# EAGLE board nano-esp-stm-breakout (EAGLE 9.6.2)
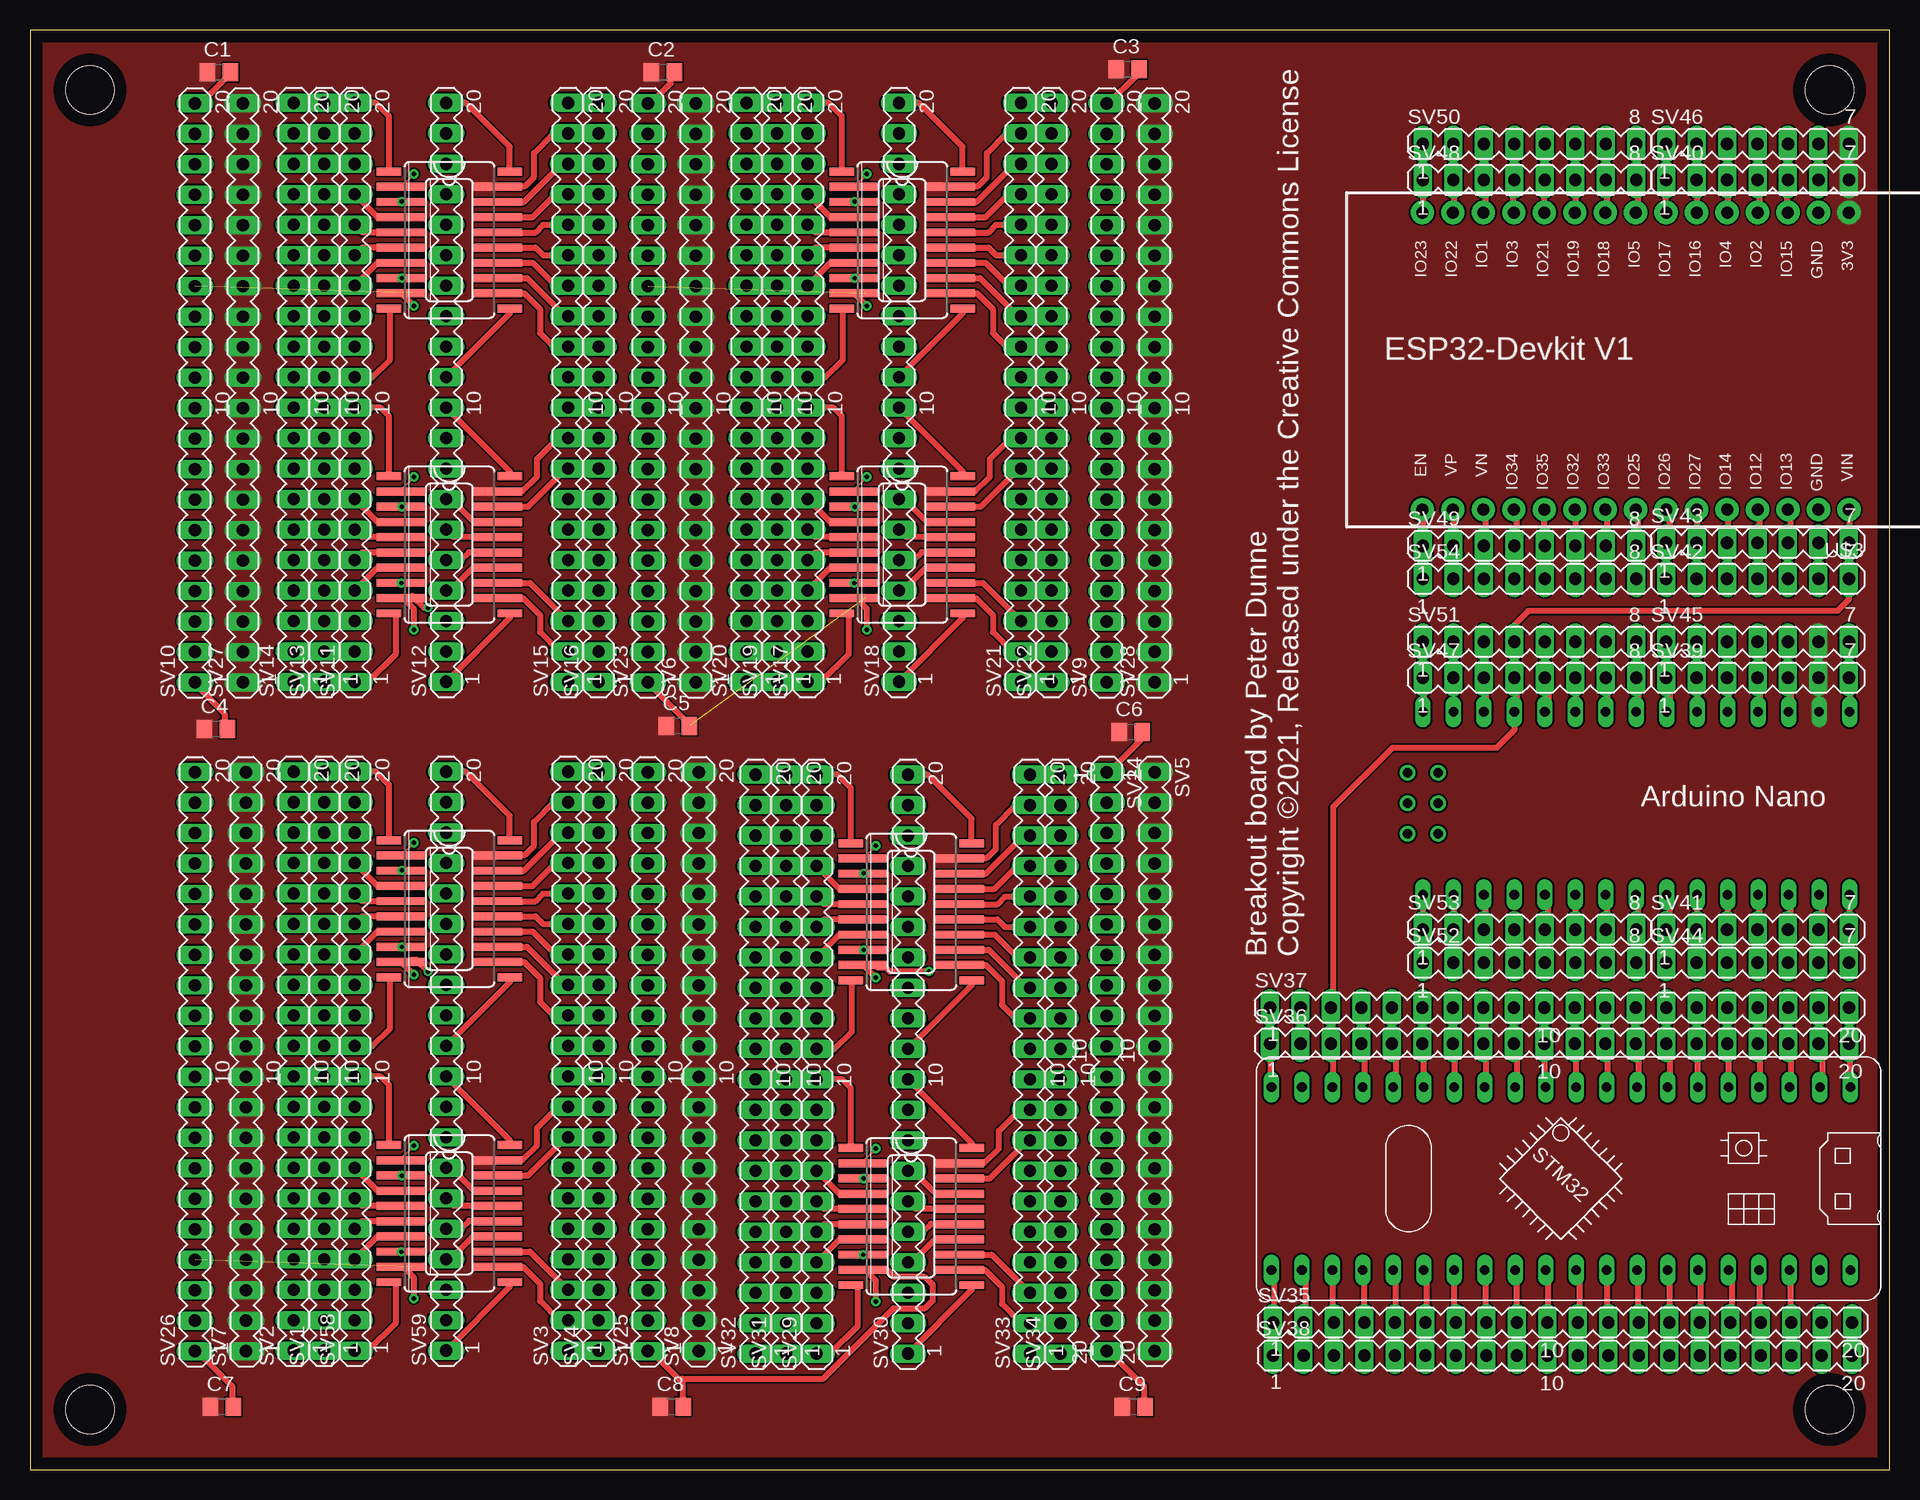
[diagram p2: board, top side]
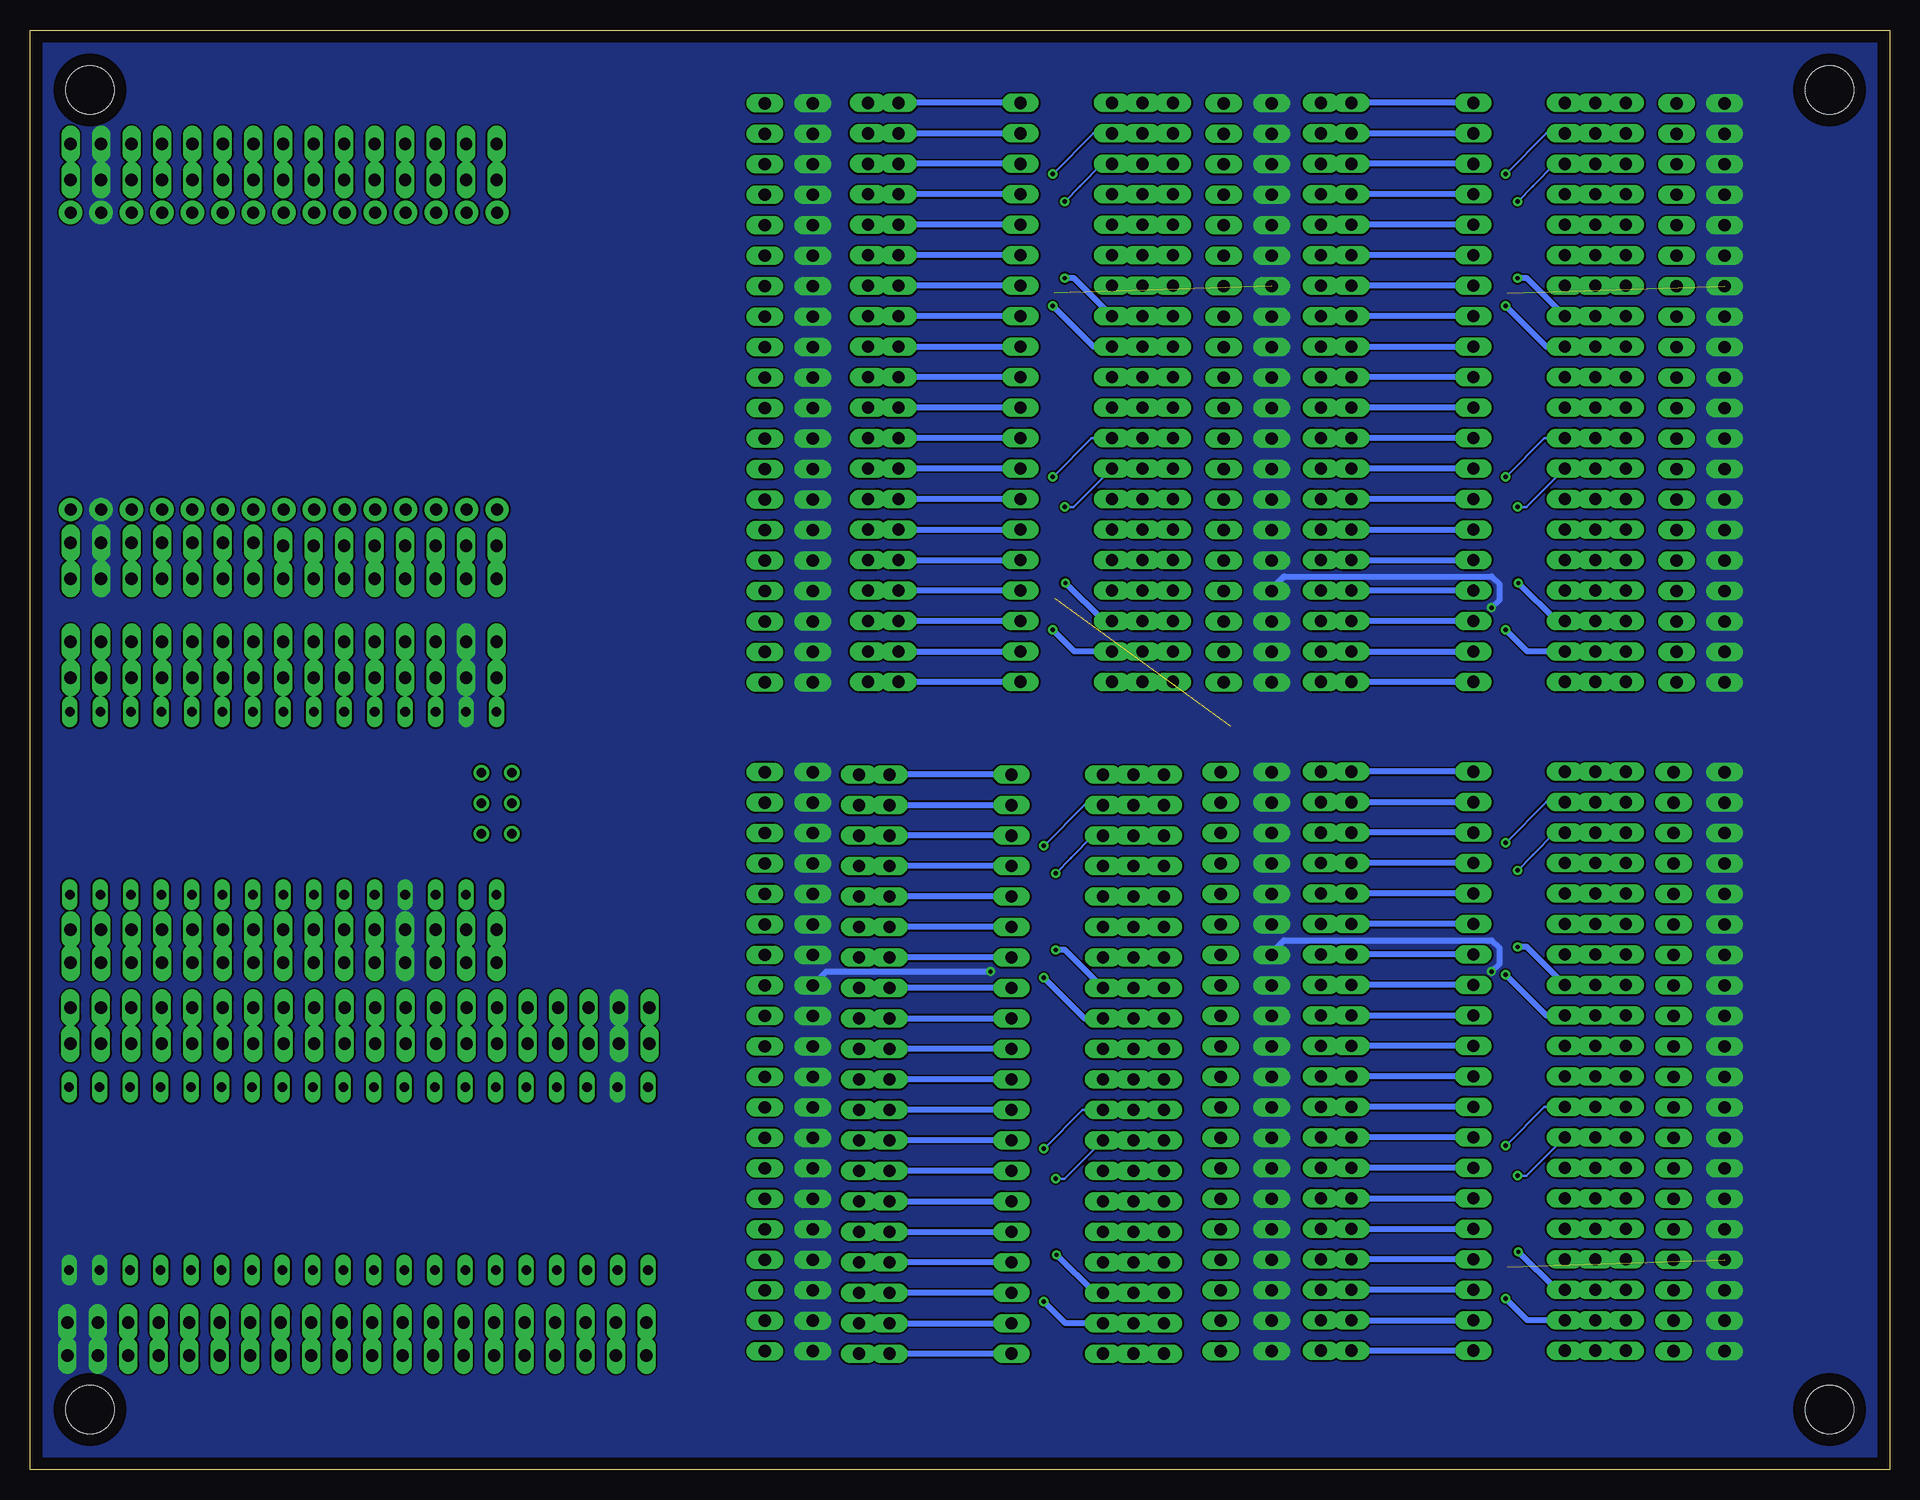
[diagram p3: board, bottom side, seen from below]

Size 155 x 120 mm. Coordinates in mm from the lower left corner, seen from the top.
Outline: 0,0 155,0 155,120 0,120 0,0
Copper layers (1*16): Top 0.035mm / dielectric 1.5mm / Bottom 0.035mm
Design rules "default *": minimum track width 0.5mm, minimum drill 0.35mm, track to track 6mil, track to pad 6mil, pad to pad 6mil, via to via 6mil, smd to smd 6mil, copper to edge 40mil, drill to drill 6mil, minimum pad ring 10mil, minimum via ring 8mil, stop-mask expansion 4mil, vias tented up to drill 0mil, thermal gap 10mil
Holes 4 mm at 5,115 150,115 150,5 5,5

## Footprints (pad centres in the part's own frame; a part is rotated, then mirrored left to right if it is on the bottom)
C0805 = smd 1.3 x 1.5: 1 -0.95,0; 2 0.95,0
SO20W = smd 0.66 x 2.032: 1 -5.715,-5.029; 2 -4.445,-5.029; 3 -3.175,-5.029; 4 -1.905,-5.029; 5 -0.635,-5.029; 6 0.635,-5.029; 7 1.905,-5.029; 8 3.175,-5.029; 9 4.445,-5.029; 10 5.715,-5.029; 11 5.715,5.029; 12 4.445,5.029; 13 3.175,5.029; 14 1.905,5.029; 15 0.635,5.029; 16 -0.635,5.029; 17 -1.905,5.029; 18 -3.175,5.029; 19 -4.445,5.029; 20 -5.715,5.029
SO16 = smd 0.66 x 2.032: 1 -4.445,-3.073; 2 -3.175,-3.073; 3 -1.905,-3.073; 4 -0.635,-3.073; 5 0.635,-3.073; 6 1.905,-3.073; 7 3.175,-3.073; 8 4.445,-3.073; 9 4.445,3.073; 10 3.175,3.073; 11 1.905,3.073; 12 0.635,3.073; 13 -0.635,3.073; 14 -1.905,3.073; 15 -3.175,3.073; 16 -4.445,3.073
MA20-1 = drill 1.016 long: 1 -24.13,0; 2 -21.59,0; 3 -19.05,0; 4 -16.51,0; 5 -13.97,0; 6 -11.43,0; 7 -8.89,0; 8 -6.35,0; 9 -3.81,0; 10 -1.27,0; 11 1.27,0; 12 3.81,0; 13 6.35,0; 14 8.89,0; 15 11.43,0; 16 13.97,0; 17 16.51,0; 18 19.05,0; 19 21.59,0; 20 24.13,0
MA07-1 = drill 1.016 long: 1 -7.62,0; 2 -5.08,0; 3 -2.54,0; 4 0,0; 5 2.54,0; 6 5.08,0; 7 7.62,0
MA08-1 = drill 1.016 long: 1 -8.89,0; 2 -6.35,0; 3 -3.81,0; 4 -1.27,0; 5 1.27,0; 6 3.81,0; 7 6.35,0; 8 8.89,0
NANO = drill 0.8 long: 3.3V -10.16,24.13; 5V -10.16,-1.27; A0 -10.16,19.05; A1 -10.16,16.51; A2 -10.16,13.97; A3 -10.16,11.43; A4 -10.16,8.89; A5 -10.16,6.35; A6 -10.16,3.81; A7 -10.16,1.27; AREF -10.16,21.59; D2 5.08,1.27; D3 5.08,3.81; D4 5.08,6.35; D5 5.08,8.89; D6 5.08,11.43; D7 5.08,13.97; D8 5.08,16.51; D9 5.08,19.05; D10 5.08,21.59; D11 5.08,24.13; D12 5.08,26.67; D13 -10.16,26.67; GND -10.16,-6.35; GND1 5.08,-1.27; RAW -10.16,-8.89; RST -10.16,-3.81; RST1 5.08,-3.81; RX1 5.08,-6.35; TX0 5.08,-8.89 | drill 0.8: ICSP1 -5.08,-10.16; ICSP2 -5.08,-7.62; ICSP3 -2.54,-10.16; ICSP4 -2.54,-7.62; ICSP5 0,-10.16; ICSP6 0,-7.62
BLUE_PILL = drill 0.8 long: P$1 -7.62,15.24; P$2 -7.62,12.7; P$3 -7.62,10.16; P$4 -7.62,7.62; P$5 -7.62,5.08; P$6 -7.62,2.54; P$7 -7.62,0; P$8 -7.62,-2.54; P$9 -7.62,-5.08; P$10 -7.62,-7.62; P$11 -7.62,-10.16; P$12 -7.62,-12.7; P$13 -7.62,-15.24; P$14 -7.62,-17.78; P$15 -7.62,-20.32; P$16 -7.62,-22.86; P$17 -7.62,-25.4; P$18 -7.62,-27.94; P$19 -7.62,-30.48; P$20 -7.62,-33.02; P$21 7.62,15.24; P$22 7.62,12.7; P$23 7.62,10.16; P$24 7.62,7.62; P$25 7.62,5.08; P$26 7.62,2.54; P$27 7.62,0; P$28 7.62,-2.54; P$29 7.62,-5.08; P$30 7.62,-7.62; P$31 7.62,-10.16; P$32 7.62,-12.7; P$33 7.62,-15.24; P$34 7.62,-17.78; P$35 7.62,-20.32; P$36 7.62,-22.86; P$37 7.62,-25.4; P$38 7.62,-27.94; P$39 7.62,-30.48; P$40 7.62,-33.02
ESP32-DEVKITV1 = drill 1 pad 1.93: 1 -22.87,-13.54; 2 -20.33,-13.54; 3 -17.79,-13.54; 4 -15.25,-13.54; 5 -12.71,-13.54; 6 -10.17,-13.54; 7 -7.63,-13.54; 8 -5.09,-13.54; 9 -2.55,-13.54; 10 -0.01,-13.54; 11 2.53,-13.54; 12 5.07,-13.54; 13 7.61,-13.54; 14 10.15,-13.54; 15 12.69,-13.54; 16 12.69,11.23; 17 10.15,11.23; 18 7.61,11.23; 19 5.07,11.23; 20 2.53,11.23; 21 -0.01,11.23; 22 -2.55,11.23; 23 -5.09,11.23; 24 -7.63,11.23; 25 -10.17,11.23; 26 -12.71,11.23; 27 -15.25,11.23; 28 -17.79,11.23; 29 -20.33,11.23; 30 -22.87,11.23

## Placement (x,y rotation side)
C1  [C0805]  15.75,116.5 0 top
C2  [C0805]  52.75,116.5 0 top
C3  [C0805]  91.5,116.75 0 top
C4  [C0805]  15.5,61.75 0 top
C5  [C0805]  54,62 0 top
C6  [C0805]  91.75,61.5 0 top
C7  [C0805]  16,5.25 0 top
C8  [C0805]  53.5,5.25 0 top
C9  [C0805]  92,5.25 0 top
IC4  74LS373DW  [SO20W]  34.96,46.74 270 top
IC6  74LS373DW  [SO20W]  34.96,102.49 270 top
IC7  74LS373DW  [SO20W]  34.96,77.09 270 top
IC8  74LS158D  [SO16]  34.94,102.49 270 top
IC9  74LS158D  [SO16]  34.94,77.09 270 top
IC10  74LS373DW  [SO20W]  72.71,102.49 270 top
IC11  74LS373DW  [SO20W]  34.96,21.34 270 top
IC12  74LS158D  [SO16]  34.94,46.74 270 top
IC13  74LS158D  [SO16]  34.94,21.34 270 top
IC14  74LS373DW  [SO20W]  72.71,77.09 270 top
IC15  74LS158D  [SO16]  72.69,102.49 270 top
IC16  74LS158D  [SO16]  72.69,77.09 270 top
IC21  74LS373DW  [SO20W]  73.46,46.49 270 top
IC22  74LS373DW  [SO20W]  73.46,21.09 270 top
IC23  74LS158D  [SO16]  73.44,46.49 270 top
IC24  74LS158D  [SO16]  73.44,21.09 270 top
SV1  [MA20-1]  24.53,34.04 90 top
SV2  [MA20-1]  21.99,34.04 90 top
SV3  [MA20-1]  44.85,34.04 90 top
SV4  [MA20-1]  47.39,34.04 90 top
SV5  [MA20-1]  93.75,34 270 top
SV6  [MA20-1]  55.5,89.75 90 top
SV7  [MA20-1]  18,34 90 top
SV8  [MA20-1]  55.75,34 90 top
SV9  [MA20-1]  89.75,89.75 90 top
SV10  [MA20-1]  13.75,89.75 90 top
SV11  [MA20-1]  27.07,89.79 90 top
SV12  [MA20-1]  34.69,89.79 90 top
SV13  [MA20-1]  24.53,89.79 90 top
SV14  [MA20-1]  21.99,89.79 90 top
SV15  [MA20-1]  44.85,89.79 90 top
SV16  [MA20-1]  47.39,89.79 90 top
SV17  [MA20-1]  64.82,89.79 90 top
SV18  [MA20-1]  72.44,89.79 90 top
SV19  [MA20-1]  62.28,89.79 90 top
SV20  [MA20-1]  59.74,89.79 90 top
SV21  [MA20-1]  82.6,89.79 90 top
SV22  [MA20-1]  85.14,89.79 90 top
SV23  [MA20-1]  51.5,89.75 90 top
SV24  [MA20-1]  89.75,34 270 top
SV25  [MA20-1]  51.5,34 90 top
SV26  [MA20-1]  13.75,34 90 top
SV27  [MA20-1]  17.75,89.75 90 top
SV28  [MA20-1]  93.75,89.75 90 top
SV29  [MA20-1]  65.57,33.79 90 top
SV30  [MA20-1]  73.19,33.79 90 top
SV31  [MA20-1]  63.03,33.79 90 top
SV32  [MA20-1]  60.49,33.79 90 top
SV33  [MA20-1]  83.35,33.79 90 top
SV34  [MA20-1]  85.89,33.79 90 top
SV35  [MA20-1]  127.75,12.25 0 top
SV36  [MA20-1]  127.5,35.5 0 top
SV37  [MA20-1]  127.5,38.5 0 top
SV38  [MA20-1]  127.75,9.5 0 top
SV39  [MA07-1]  144,66 0 top
SV40  [MA07-1]  144,107.5 0 top
SV41  [MA07-1]  144,45 0 top
SV42  [MA07-1]  144,74.25 0 top
SV43  [MA07-1]  144,77.25 0 top
SV44  [MA07-1]  144,42.25 0 top
SV45  [MA07-1]  144,69 0 top
SV46  [MA07-1]  144,110.5 0 top
SV47  [MA08-1]  125,66 0 top
SV48  [MA08-1]  125,107.5 0 top
SV49  [MA08-1]  125,77 0 top
SV50  [MA08-1]  125,110.5 0 top
SV51  [MA08-1]  125,69 0 top
SV52  [MA08-1]  125,42.25 0 top
SV53  [MA08-1]  125,45 0 top
SV54  [MA08-1]  125,74.25 0 top
SV58  [MA20-1]  27.07,34.04 90 top
SV59  [MA20-1]  34.69,34.04 90 top
U$1  NANO  [NANO]  125,53 270 top
U$2  [BLUE_PILL]  136.5,24.25 270 top
U$3  ESP32DEVKITV1  [ESP32-DEVKITV1]  128.75,91.25 180 top

## Tracks (layer width: path | path; a pad name or v marks a point on that pad's centre or on a via)
GND  (via drill 0.35)  (4 unrouted)
  Top 0.5: C7.2 16.86,5.29 16.86,6.93 13.93,9.86 SV26.1 | 54.21,7.42 51.77,9.86 SV25.1 | 54.21,7.42 54.38,7.25 54.38,5.29 C8.2 | C4.2 16.21,62.05 16.21,63.03 13.93,65.32 SV10.1 | C9.2 92.87,5.29 92.87,6.93 89.93,9.86 SV24.20 | C5.2 54.7,62.05 54.7,62.38 51.77,65.32 SV23.1 | C1.2 16.54,116.2 13.93,113.59 SV10.20 | C6.2 92.54,61.4 92.54,60.75 89.93,58.14 SV24.1 | C2.2 53.4,116.2 53.4,115.55 51.77,113.92 SV23.20 | C3.2 92.21,116.53 92.21,116.2 89.93,113.92 SV9.20 | v33.17,41.5 32.19,42.48 31.87,42.48 IC12.8 | IC24.8 70.69,16.71 71.34,16.71 71.99,16.06 74.6,16.06 75.25,15.41 75.25,14.1 74.6,13.45 71.99,13.45 66.12,7.58 54.38,7.58 54.21,7.42 | v33.17,71.84 32.85,71.84 31.87,72.82 IC9.8 | v74.93,41.5 71.66,41.5 71.34,41.83 70.69,41.83 IC23.8
  Bottom 0.5: v33.17,41.5 32.52,42.16 32.52,43.46 33.17,44.11 50.46,44.11 51.44,43.13 SV25.14 | v33.17,71.84 32.52,72.49 32.52,73.8 33.17,74.45 50.46,74.45 51.44,73.47 SV23.4 | v74.93,41.5 88.63,41.5 89.61,40.52 SV24.8
  pour Bottom (no thermals): -3.5,120 -3.5,-4.75 157.75,-4.75 157.75,120
N$1
  Top 0.5: U$1.A3 136.68,63.26 136.68,65.87 SV39.1 136.35,66.2 136.35,68.81 SV45.1
N$2
  Top 0.5: U$1.A2 138.96,63.26 138.96,65.87 SV39.2 138.96,66.2 138.96,68.81 SV45.2
N$3
  Top 0.5: U$2.P$23 146.79,16.31 146.79,12.4 SV35.18 146.79,12.07 146.79,9.79 SV38.18
N$4
  Top 0.5: U$2.P$24 144.18,16.31 144.18,12.4 SV35.17 144.18,12.07 144.18,9.79 SV38.17
N$5
  Top 0.5: U$2.P$25 141.9,16.31 141.9,12.4 SV35.16 141.9,12.07 141.9,9.79 SV38.16
N$6
  Top 0.5: U$2.P$26 139.29,16.31 139.29,12.4 SV35.15 139.29,12.07 139.29,9.79 SV38.15
N$7
  Top 0.5: U$2.P$27 136.68,16.31 136.68,12.4 SV35.14 136.68,12.07 136.68,9.79 SV38.14
N$8
  Top 0.5: U$2.P$28 134.07,16.31 134.07,12.4 SV35.13 134.07,12.07 134.07,9.79 SV38.13
N$9
  Top 0.5: U$2.P$29 131.46,16.31 131.46,12.4 SV35.12 131.46,12.07 131.46,9.79 SV38.12
N$10
  Top 0.5: U$2.P$30 129.18,16.31 129.18,12.4 SV35.11 129.18,12.07 129.18,9.79 SV38.11
N$11
  Top 0.5: U$2.P$31 126.57,16.31 126.57,12.4 SV35.10 126.57,12.07 126.57,9.79 SV38.10
N$12
  Top 0.5: U$2.P$32 123.96,16.31 123.96,12.4 SV35.9 123.96,12.07 123.96,9.79 SV38.9
N$13
  Top 0.5: U$2.P$33 121.35,16.31 121.35,12.4 SV35.8 121.35,12.07 121.35,9.79 SV38.8
N$14
  Top 0.5: U$2.P$34 118.74,16.31 118.74,12.4 SV35.7 119.06,12.07 119.06,9.79 SV38.7
N$15
  Top 0.5: U$2.P$35 116.45,16.31 116.45,12.4 SV35.6 116.45,12.07 116.45,9.79 SV38.6
N$16
  Top 0.5: U$2.P$36 113.84,16.31 113.84,12.4 SV35.5 113.84,12.07 113.84,9.79 SV38.5
N$17
  Top 0.5: U$2.P$37 111.23,16.31 111.23,12.4 SV35.4 111.23,12.07 111.23,9.79 SV38.4
N$18
  Top 0.5: U$2.P$38 108.62,16.31 108.62,12.4 SV35.3 108.62,12.07 108.62,9.79 SV38.3
N$19
  Top 0.5: U$2.P$39 106.34,16.31 106.34,12.4 SV35.2 106.34,12.07 106.34,9.79 SV38.2
N$20
  Top 0.5: U$2.P$40 103.73,16.31 103.73,12.4 SV35.1 103.73,12.07 103.73,9.79 SV38.1
N$21
  Top 0.5: U$2.P$20 103.41,31.97 103.41,35.23 SV36.1 103.41,35.56 103.41,38.49 SV37.1
N$22
  Top 0.5: U$1.A1 141.57,63.26 141.57,65.87 SV39.3 141.57,66.2 141.57,68.81 SV45.3
N$24
  Top 0.5: U$2.P$17 111.23,31.97 111.23,35.23 SV36.4 110.91,35.56 110.91,38.49 SV37.4
N$25
  Top 0.5: U$2.P$16 113.84,31.97 113.84,35.23 SV36.5 113.52,35.56 113.52,38.49 SV37.5
N$26
  Top 0.5: U$2.P$15 116.13,31.97 116.13,35.23 SV36.6 116.13,35.56 116.13,38.49 SV37.6
N$27
  Top 0.5: U$2.P$14 118.74,31.97 118.74,35.23 SV36.7 118.74,35.56 118.74,38.49 SV37.7
N$28
  Top 0.5: U$2.P$13 121.35,31.97 121.35,35.23 SV36.8 121.35,35.56 121.35,38.49 SV37.8
N$29
  Top 0.5: U$2.P$12 123.96,31.97 123.96,35.23 SV36.9 123.63,35.56 123.63,38.49 SV37.9
N$30
  Top 0.5: U$2.P$11 126.24,31.97 126.24,35.23 SV36.10 126.24,35.56 SV37.10
N$31
  Top 0.5: U$2.P$10 128.85,31.97 128.85,35.23 SV36.11 128.85,35.56 128.85,38.49 SV37.11
N$32
  Top 0.5: U$2.P$9 131.46,31.97 131.46,35.23 SV36.12 131.46,35.56 131.46,38.49 SV37.12
N$33
  Top 0.5: U$2.P$8 134.07,31.97 134.07,35.23 SV36.13 133.74,35.56 133.74,38.49 SV37.13
N$34
  Top 0.5: U$2.P$7 136.68,31.97 136.68,35.23 SV36.14 136.35,35.56 136.35,38.49 SV37.14
N$35
  Top 0.5: U$2.P$6 138.96,31.97 138.96,35.23 SV36.15 138.96,35.56 138.96,38.49 SV37.15
N$36
  Top 0.5: U$2.P$5 141.57,31.97 141.57,35.23 SV36.16 141.57,35.56 141.57,38.49 SV37.16
N$37
  Top 0.5: U$2.P$4 144.18,31.97 144.18,35.23 SV36.17 144.18,35.56 144.18,38.49 SV37.17
N$38
  Top 0.5: U$2.P$3 146.79,31.97 146.79,35.23 SV36.18 146.46,35.56 146.46,38.49 SV37.18
N$39
  Top 0.5: U$2.P$2 149.4,31.97 149.4,35.23 SV36.19 149.07,35.56 149.07,38.49 SV37.19
N$40
  Top 0.5: U$2.P$1 151.68,31.97 151.68,35.23 SV36.20 151.68,35.56 151.68,38.49 SV37.20
N$41  (via drill 0.35)
  Top 0.5: SV14.2 SV13.2 SV11.2 | v32,70 32,71.75 31.11,72.64 IC7.9
  Bottom 0.5: SV11.2 30.2,68.2 v32,70
N$42
  Top 0.5: IC7.7 28.98,75.19 SV11.4 SV13.4 SV14.4
N$43
  Top 0.5: IC7.6 27.7,76.45 SV11.5 SV13.5 SV14.5 | SV14.5 21.93,75.82 21.75,76 21.81,76 SV14.5
N$44
  Top 0.5: IC7.5 27.7,77.72 SV11.6 SV13.6 SV14.6
N$45  (via drill 0.35)
  Top 0.2: IC7.3 30.98,80.27 v31,80.25
  Bottom 0.2: v31,80.25 30.26,80.25 SV11.8
  Bottom 0.5: SV11.8 SV13.8 22.08,83.44 | 22.08,83.44 SV14.8 | SV14.8 21.81,83.44 21.75,83.5 | SV14.8 22.08,83.58 22.08,83.44
N$46  (via drill 0.35)
  Top 0.2: IC7.2 30.79,81.53 v32,82.75
  Bottom 0.2: v32,82.75 28.77,85.98 SV11.9
  Bottom 0.5: SV11.9 SV13.9 22.08,85.98 | 22.08,85.98 SV14.9 | SV14.9 21.77,85.98 21.75,86 | SV14.9 22.08,86.19 22.08,85.98
N$47
  Top 0.5: IC7.1 29.93,87.82 29.23,88.52 SV11.10 SV13.10 24.36,88.48 24.36,88.52 | SV14.10 24.36,88.52 | 24.36,88.52 24.48,88.52
N$48
  Top 0.5: SV14.11 SV13.11 SV11.11 28.56,91.06 30,92.5 30,96.71 IC6.10
N$49  (via drill 0.35)
  Top 0.5: SV14.12 SV13.12 | SV13.12 24.6,93.6 | 24.6,93.6 24.75,93.75 | SV11.12 24.6,93.6 | IC6.9 30.95,98.05 v32,97 | SV13.12 24.69,93.7 24.6,93.6
  Bottom 0.5: v32,97 28.6,93.6 SV11.12
N$50
  Top 0.5: IC6.7 28.98,100.58 SV11.14 SV13.14 SV14.14 | SV14.14 21.93,98.68 21.75,98.5 21.81,98.5 SV14.14
N$51
  Top 0.5: IC6.6 27.7,101.86 SV11.15 SV13.15 SV14.15
N$52
  Top 0.5: IC6.5 27.7,103.12 SV11.16 SV13.16 SV14.16
N$53  (via drill 0.35)
  Top 0.2: IC6.3 30.91,105.67 v31,105.7
  Top 0.5: SV14.18 SV13.18 SV11.18
  Bottom 0.2: v31,105.7 29.73,106.98 27.91,108.84 SV11.18
N$54  (via drill 0.35)
  Top 0.2: IC6.2 30.93,106.94 v32,108
  Top 0.5: SV14.19 SV13.19 SV11.19 | SV11.19 27.12,111.38 27.25,111.25 27.2,111.25 SV11.19
  Bottom 0.2: v32,108 28.62,111.38 SV11.19
N$55
  Top 0.5: IC6.1 29.93,112.82 28.83,113.92 SV11.20 SV13.20 SV14.20
N$56
  Top 0.5: SV12.1 39.99,70.96 IC7.11
  Bottom 0.5: SV12.1 SV15.1 SV16.1 | SV16.1 47.52,65.66 | 47.52,65.66 47.66,65.66 47.75,65.75 | SV16.1 47.52,65.64 47.52,65.66
N$57
  Top 0.5: IC7.12 41.1,72.64 42.5,71.25 42.5,69.8 44.1,68.2 SV15.2
  Bottom 0.5: SV16.2 SV15.2 SV12.2
N$58
  Top 0.5: IC7.13 41.67,73.92 SV15.3
  Bottom 0.5: SV12.3 SV15.3 SV16.3 | SV16.3 47.52,70.74 | 47.52,70.74 47.74,70.74 47.75,70.75 | SV16.3 47.52,70.86 47.52,70.74
N$59
  Top 0.5: IC7.14 36.94,75.19 35.03,73.28 SV12.4
  Bottom 0.5: SV12.4 SV15.4 SV16.4
N$60
  Top 0.5: SV12.5 35.91,75.82 36.59,76.5 36.64,76.45 IC7.15
  Bottom 0.5: SV16.5 SV15.5 SV12.5
N$61
  Top 0.5: IC7.16 35.33,77.72 SV12.6
  Bottom 0.5: SV16.6 SV15.6 SV12.6
N$62
  Top 0.5: IC7.17 37.01,79 35.1,80.9 SV12.7
  Bottom 0.5: SV12.7 SV15.7 SV16.7
N$63
  Top 0.5: IC7.18 41.52,80.27 44.69,83.44 SV15.8
  Bottom 0.5: SV16.8 44.91,83.44 | 44.91,83.44 SV15.8 | SV15.8 44.56,83.44 44.5,83.5 34.75,83.5 SV12.8 | SV15.8 44.91,83.58 44.91,83.44
N$64
  Top 0.5: IC7.19 41.03,81.53 42.25,82.75 42.25,84.25 44,86 44.59,86 | 44.59,86 45,86 | 44.59,86 44.59,86.19 SV15.9
  Bottom 0.5: SV12.9 SV15.9 SV16.9
N$65
  Top 0.5: IC7.20 39.99,83.22 SV12.10
  Bottom 0.5: SV12.10 SV15.10 SV16.10
N$66
  Top 0.5: IC6.11 39.99,96.36 SV12.11
  Bottom 0.5: SV12.11 SV15.11 SV16.11
N$67
  Top 0.5: IC6.12 41.2,98.05 42.5,96.75 42.5,94.75 43.65,93.6 SV15.12
  Bottom 0.5: SV16.12 SV15.12 SV12.12
N$68
  Top 0.5: IC6.13 41.44,99.31 44.61,96.14 SV15.13
  Bottom 0.5: SV12.13 SV15.13 SV16.13 47.5,96.25
N$69
  Top 0.5: IC6.14 41.91,100.58 43.82,98.68 SV15.14
  Bottom 0.5: SV12.14 SV15.14 SV16.14
N$70
  Top 0.5: IC6.15 42.15,101.86 42.78,101.22 SV15.15
  Bottom 0.5: SV12.15 SV15.15 SV16.15 | SV16.15 47.52,101.22 | 47.52,101.22 47.72,101.22 47.75,101.25 | SV16.15 47.52,101.2 47.52,101.22
N$71
  Top 0.5: IC6.16 42.12,103.12 42.76,103.76 SV15.16
  Bottom 0.5: SV12.16 SV15.16 SV16.16
N$72
  Top 0.5: IC6.17 41.9,104.39 43.8,106.3 SV15.17
  Bottom 0.5: SV12.17 SV15.17 SV16.17
N$73
  Top 0.5: IC6.18 41.16,105.67 44.34,108.84 SV15.18
  Bottom 0.5: SV12.18 SV15.18 SV16.18 | SV16.18 47.41,108.84 | 47.41,108.84 47.5,108.75 | SV16.18 47.52,109.03 47.41,108.84
N$74
  Top 0.5: IC6.19 40.05,107 41.25,107 42,107.75 42,109.75 43.63,111.38 SV15.19
  Bottom 0.5: SV16.19 SV15.19 SV12.19
N$75
  Top 0.5: IC7.10 30.38,71.38 30.5,71.25 30.5,68 28.16,65.66 SV11.1 SV13.1 SV14.1
N$76  (via drill 0.35)
  Top 0.5: IC7.8 30.84,74 v30.95,73.9
  Bottom 0.5: v30.95,73.9 27.74,70.74 SV11.3 SV13.3 SV14.3
N$77
  Top 0.5: IC7.4 28.98,79 SV11.7 SV13.7 SV14.7
N$78  (via drill 0.35)
  Top 0.254: IC6.8 v31,99.31
  Top 0.5: SV14.13 SV13.13 SV11.13
  Bottom 0.5: SV11.13 30.25,99.31 v31,99.31
N$79
  Top 0.5: IC6.4 28.98,104.39 SV11.17 SV13.17 SV14.17
N$80
  Top 0.5: IC6.20 39.99,110.26 36.33,113.92 SV12.20
  Bottom 0.5: SV12.20 SV15.20 SV16.20
N$81  (via drill 0.35)
  Top 0.5: SV20.2 SV19.2 SV17.2 | v69.75,70 69.75,71.75 68.86,72.64 IC14.9
  Bottom 0.5: SV17.2 67.95,68.2 v69.75,70
N$82
  Top 0.5: IC14.7 66.72,75.19 SV17.4 SV19.4 SV20.4
N$83
  Top 0.5: IC14.6 65.45,76.45 SV17.5 SV19.5 SV20.5 | SV20.5 59.68,75.82 59.5,76 59.56,76 SV20.5
N$84
  Top 0.5: IC14.5 65.45,77.72 SV17.6 SV19.6 SV20.6
N$85  (via drill 0.35)
  Top 0.2: IC14.3 68.73,80.27 v68.75,80.25
  Bottom 0.2: v68.75,80.25 68.01,80.25 SV17.8
  Bottom 0.5: SV17.8 SV19.8 59.92,83.44 | 59.92,83.44 SV20.8 | SV20.8 59.56,83.44 59.5,83.5 | SV20.8 59.92,83.58 59.92,83.44
N$86  (via drill 0.35)
  Top 0.2: IC14.2 68.53,81.53 v69.75,82.75
  Bottom 0.2: v69.75,82.75 66.52,85.98 SV17.9
  Bottom 0.5: SV17.9 SV19.9 59.92,85.98 | 59.92,85.98 SV20.9 | SV20.9 59.52,85.98 59.5,86 | SV20.9 59.92,86.19 59.92,85.98
N$87
  Top 0.5: IC14.1 67.68,87.82 66.98,88.52 SV17.10 SV19.10 62.2,88.48 62.2,88.52 | SV20.10 62.2,88.52 | 62.2,88.52 62.23,88.52
N$88
  Top 0.5: SV20.11 SV19.11 SV17.11 66.31,91.06 67.75,92.5 67.75,96.71 IC10.10
N$89  (via drill 0.35)
  Top 0.5: SV20.12 62.2,93.6 | 62.2,93.6 SV19.12 | SV19.12 62.35,93.6 | 62.35,93.6 62.5,93.75 | SV17.12 62.35,93.6 | IC10.9 68.7,98.05 v69.75,97 | SV19.12 62.2,93.7 62.2,93.6
  Bottom 0.5: v69.75,97 66.35,93.6 SV17.12
N$90
  Top 0.5: IC10.7 66.72,100.58 SV17.14 SV19.14 SV20.14 | SV20.14 59.68,98.68 59.5,98.5 59.56,98.5 SV20.14
N$91
  Top 0.5: IC10.6 65.45,101.86 SV17.15 SV19.15 SV20.15
N$92
  Top 0.5: IC10.5 65.45,103.12 SV17.16 SV19.16 SV20.16
N$93  (via drill 0.35)
  Top 0.2: IC10.3 68.67,105.67 v68.75,105.7
  Top 0.5: SV20.18 SV19.18 SV17.18
  Bottom 0.2: v68.75,105.7 67.48,106.98 65.66,108.84 SV17.18
N$94  (via drill 0.35)
  Top 0.2: IC10.2 68.69,106.94 v69.75,108
  Top 0.5: SV20.19 SV19.19 SV17.19 | SV17.19 64.87,111.38 65,111.25 64.95,111.25 SV17.19
  Bottom 0.2: v69.75,108 66.37,111.38 SV17.19
N$95
  Top 0.5: IC10.1 67.68,112.82 66.58,113.92 SV17.20 SV19.20 SV20.20
N$96
  Top 0.5: SV18.1 77.74,70.96 IC14.11
  Bottom 0.5: SV18.1 SV21.1 85.04,65.66 | 85.04,65.66 SV22.1 | SV22.1 85.41,65.66 85.5,65.75 | SV22.1 85.04,65.64 85.04,65.66
N$97
  Top 0.5: IC14.12 78.86,72.64 80.25,71.25 80.25,69.8 81.85,68.2 SV21.2
  Bottom 0.5: SV22.2 SV21.2 SV18.2
N$98
  Top 0.5: IC14.13 79.42,73.92 SV21.3
  Bottom 0.5: SV18.3 SV21.3 85.04,70.74 | 85.04,70.74 SV22.3 | SV22.3 85.49,70.74 85.5,70.75 | SV22.3 85.04,70.86 85.04,70.74
N$99
  Top 0.5: IC14.14 74.69,75.19 72.78,73.28 SV18.4
  Bottom 0.5: SV18.4 SV21.4 SV22.4
N$100
  Top 0.5: SV18.5 73.67,75.82 74.34,76.5 74.39,76.45 IC14.15
  Bottom 0.5: SV22.5 SV21.5 SV18.5
N$101
  Top 0.5: IC14.16 73.08,77.72 SV18.6
  Bottom 0.5: SV22.6 SV21.6 SV18.6
N$102
  Top 0.5: IC14.17 74.75,79 72.85,80.9 SV18.7
  Bottom 0.5: SV18.7 SV21.7 SV22.7
N$103
  Top 0.5: IC14.18 79.27,80.27 82.44,83.44 SV21.8
  Bottom 0.5: SV22.8 82.75,83.44 | 82.75,83.44 SV21.8 | SV21.8 82.31,83.44 82.25,83.5 72.5,83.5 SV18.8 | SV21.8 82.75,83.58 82.75,83.44
N$104
  Top 0.5: IC14.19 78.78,81.53 80,82.75 80,84.25 81.75,86 82.43,86 | 82.43,86 82.75,86 | 82.43,86 82.43,86.19 SV21.9
  Bottom 0.5: SV18.9 SV21.9 SV22.9
N$105
  Top 0.5: IC14.20 77.74,83.22 SV18.10
  Bottom 0.5: SV18.10 SV21.10 SV22.10
N$106
  Top 0.5: IC10.11 77.74,96.36 SV18.11
  Bottom 0.5: SV18.11 SV21.11 SV22.11
N$107
  Top 0.5: IC10.12 78.95,98.05 80.25,96.75 80.25,94.75 81.4,93.6 SV21.12
  Bottom 0.5: SV22.12 SV21.12 SV18.12
N$108
  Top 0.5: IC10.13 79.19,99.31 82.36,96.14 SV21.13
  Bottom 0.5: SV18.13 SV21.13 SV22.13 85.25,96.25
N$109
  Top 0.5: IC10.14 79.67,100.58 81.57,98.68 SV21.14
  Bottom 0.5: SV18.14 SV21.14 SV22.14
N$110
  Top 0.5: IC10.15 79.89,101.86 80.53,101.22 SV21.15
  Bottom 0.5: SV18.15 SV21.15 85.04,101.22 | 85.04,101.22 SV22.15 | SV22.15 85.47,101.22 85.5,101.25 | SV22.15 85.04,101.2 85.04,101.22
N$111
  Top 0.5: IC10.16 79.88,103.12 80.51,103.76 SV21.16
  Bottom 0.5: SV18.16 SV21.16 SV22.16
N$112
  Top 0.5: IC10.17 79.64,104.39 81.55,106.3 SV21.17
  Bottom 0.5: SV18.17 SV21.17 SV22.17
N$113
  Top 0.5: IC10.18 78.92,105.67 82.09,108.84 SV21.18
  Bottom 0.5: SV18.18 SV21.18 85.04,108.84 | 85.04,108.84 SV22.18 | SV22.18 85.16,108.84 85.25,108.75 | SV22.18 85.04,109.03 85.04,108.84
N$114
  Top 0.5: IC10.19 77.8,107 79,107 79.75,107.75 79.75,109.75 81.38,111.38 SV21.19
  Bottom 0.5: SV22.19 SV21.19 SV18.19
N$115
  Top 0.5: IC14.10 68.12,71.38 68.25,71.25 68.25,68 65.91,65.66 SV17.1 SV19.1 SV20.1
N$116  (via drill 0.35)
  Top 0.5: IC14.8 68.58,74 v68.7,73.9
  Bottom 0.5: v68.7,73.9 65.49,70.74 SV17.3 SV19.3 SV20.3
N$117
  Top 0.5: IC14.4 66.72,79 SV17.7 SV19.7 SV20.7
N$118  (via drill 0.35)
  Top 0.254: IC10.8 v68.75,99.31
  Top 0.5: SV20.13 SV19.13 SV17.13
  Bottom 0.5: SV17.13 68,99.31 v68.75,99.31
N$119
  Top 0.5: IC10.4 66.72,104.39 SV17.17 SV19.17 SV20.17
N$120
  Top 0.5: IC10.20 77.74,110.26 74.08,113.92 SV18.20
  Bottom 0.5: SV18.20 SV21.20 SV22.20
N$121
  Top 0.5: U$1.A0 144.18,63.26 144.18,65.87 SV39.4 144.18,66.2 144.18,68.81 SV45.4
N$122
  Top 0.5: U$1.AREF 146.79,63.26 146.79,65.87 SV39.5 146.46,66.2 146.46,68.81 SV45.5
N$124
  Top 0.5: U$1.D13 151.68,63.26 151.68,65.87 SV39.7 151.68,66.2 151.68,68.81 SV45.7
N$125
  Top 0.5: U$3.7 136.35,105.02 136.35,107.3 SV40.1 136.35,107.62 136.35,110.23 SV46.1
N$126
  Top 0.5: U$3.6 138.96,105.02 138.96,107.3 SV40.2 138.96,107.62 138.96,110.23 SV46.2
N$127
  Top 0.5: U$3.5 141.57,105.02 141.57,107.3 SV40.3 141.57,107.62 141.57,110.23 SV46.3
N$128
  Top 0.5: U$3.4 144.18,105.02 144.18,107.3 SV40.4 144.18,107.62 144.18,110.23 SV46.4
N$129
  Top 0.5: U$3.3 146.46,105.02 146.46,107.3 SV40.5 146.46,107.62 146.46,110.23 SV46.5
N$132
  Top 0.5: U$1.D6 136.68,47.6 136.68,45.32 SV41.1 136.35,44.99 136.35,42.38 SV44.1
N$133
  Top 0.5: U$1.D7 138.96,47.6 138.96,45.32 SV41.2 138.96,44.99 138.96,42.38 SV44.2
N$134
  Top 0.5: U$1.D8 141.57,47.6 141.57,45.32 SV41.3 141.57,44.99 141.57,42.38 SV44.3
N$135
  Top 0.5: U$1.D9 144.18,47.6 144.18,45.32 SV41.4 144.18,44.99 144.18,42.38 SV44.4
N$136
  Top 0.5: U$1.D10 146.79,47.6 146.79,45.32 SV41.5 146.46,44.99 146.46,42.38 SV44.5
N$137
  Top 0.5: U$1.D11 149.4,47.6 149.4,45.32 SV41.6 149.07,42.38 SV44.6
N$138
  Top 0.5: U$1.D12 151.68,47.6 151.68,45.32 SV41.7 151.68,44.99 151.68,42.38 SV44.7
N$139
  Top 0.5: SV42.1 136.35,74.35 136.35,76.96 SV43.1 136.68,77.29 136.68,79.9 U$3.24
N$140
  Top 0.5: SV42.2 138.96,74.35 138.96,76.96 SV43.2 138.96,77.29 138.96,79.9 U$3.25
N$141
  Top 0.5: SV42.3 141.57,74.35 141.57,76.96 SV43.3 141.57,77.29 141.57,79.9 U$3.26
N$142
  Top 0.5: SV42.4 144.18,74.35 144.18,76.96 SV43.4 144.18,77.29 144.18,79.9 U$3.27
N$143
  Top 0.5: SV42.5 146.46,74.35 146.46,76.96 SV43.5 146.79,77.29 146.79,79.9 U$3.28
N$146
  Top 0.5: U$1.RAW 116.13,63.26 116.13,65.87 SV47.1 116.13,66.2 116.13,68.81 SV51.1
N$148
  Top 0.5: U$1.RST 121.35,63.26 121.35,65.87 SV47.3 121.35,66.2 121.35,68.81 SV51.3
N$150
  Top 0.5: U$1.A7 126.57,63.26 126.57,65.87 SV47.5 126.24,66.2 126.24,68.81 SV51.5
N$151
  Top 0.5: U$1.A6 128.85,63.26 128.85,65.87 SV47.6 128.85,66.2 128.85,68.81 SV51.6
N$152
  Top 0.5: U$1.A5 131.46,63.26 131.46,65.87 SV47.7 131.46,66.2 131.46,68.81 SV51.7
N$153
  Top 0.5: U$1.A4 134.07,63.26 134.07,65.87 SV47.8 134.07,66.2 134.07,68.81 SV51.8
N$154
  Top 0.5: SV54.1 116.13,74.35 116.13,76.96 SV49.1 116.13,77.29 116.13,79.9 U$3.16
N$155
  Top 0.5: SV54.2 118.74,74.35 118.74,76.96 SV49.2 118.74,77.29 118.74,79.9 U$3.17
N$156
  Top 0.5: SV54.3 121.35,74.35 121.35,76.96 SV49.3 121.35,77.29 121.35,79.9 U$3.18
N$157
  Top 0.5: SV54.4 123.63,74.35 123.63,76.96 SV49.4 123.96,77.29 123.96,79.9 U$3.19
N$158
  Top 0.5: SV54.5 126.24,74.35 126.24,76.96 SV49.5 126.24,77.29 126.24,79.9 U$3.20
N$159
  Top 0.5: SV54.6 128.85,74.35 128.85,76.96 SV49.6 128.85,77.29 128.85,79.9 U$3.21
N$160
  Top 0.5: SV54.7 131.46,74.35 131.46,76.96 SV49.7 131.46,77.29 131.46,79.9 U$3.22
N$161  (via drill 0.35)
  Top 0.5: SV32.2 SV31.2 SV29.2 | v70.5,14 70.5,15.75 69.61,16.64 IC22.9
  Bottom 0.5: SV29.2 68.7,12.2 v70.5,14
N$162
  Top 0.5: IC22.7 67.47,19.18 SV29.4 SV31.4 SV32.4
N$163
  Top 0.5: IC22.6 66.2,20.45 SV29.5 SV31.5 SV32.5 | SV32.5 60.43,19.82 60.25,20 60.31,20 SV32.5
N$164
  Top 0.5: IC22.5 66.2,21.73 SV29.6 SV31.6 SV32.6
N$165  (via drill 0.35)
  Top 0.2: IC22.3 69.48,24.27 v69.5,24.25
  Bottom 0.2: v69.5,24.25 68.76,24.25 SV29.8
  Bottom 0.5: SV29.8 SV31.8 60.57,27.44 | 60.57,27.44 SV32.8 | SV32.8 60.31,27.44 60.25,27.5 | SV32.8 60.57,27.48 60.57,27.44
N$166  (via drill 0.35)
  Top 0.2: IC22.2 69.28,25.54 v70.5,26.75
  Bottom 0.2: v70.5,26.75 67.27,29.98 SV29.9
  Bottom 0.5: SV29.9 SV31.9 60.57,29.98 | 60.57,29.98 SV32.9 | SV32.9 60.27,29.98 60.25,30 | SV32.9 60.57,30.09 60.57,29.98
N$167
  Top 0.5: IC22.1 68.43,31.82 67.73,32.52 SV29.10 SV31.10 62.86,32.7 62.86,32.52 | SV32.10 62.86,32.52 | 62.86,32.52 62.98,32.52
N$168
  Top 0.5: SV32.11 SV31.11 SV29.11 67.06,35.06 68.5,36.5 68.5,40.71 IC21.10
N$169  (via drill 0.35)
  Top 0.5: SV32.12 SV31.12 | SV31.12 63.1,37.6 | 63.1,37.6 63.25,37.75 | SV29.12 63.1,37.6 | IC21.9 69.45,42.05 v70.5,41 | SV31.12 63.18,37.59 63.1,37.6
  Bottom 0.5: v70.5,41 67.1,37.6 SV29.12
N$170
  Top 0.5: IC21.7 67.47,44.59 SV29.14 SV31.14 SV32.14 | SV32.14 60.43,42.68 60.25,42.5 60.31,42.5 SV32.14
N$171
  Top 0.5: IC21.6 66.2,45.85 SV29.15 SV31.15 SV32.15
N$172
  Top 0.5: IC21.5 66.2,47.12 SV29.16 SV31.16 SV32.16
N$173  (via drill 0.35)
  Top 0.2: IC21.3 69.42,49.66 v69.5,49.7
  Top 0.5: SV32.18 SV31.18 SV29.18
  Bottom 0.2: v69.5,49.7 68.23,50.98 66.41,52.84 SV29.18
N$174  (via drill 0.35)
  Top 0.2: IC21.2 69.44,50.94 v70.5,52
  Top 0.5: SV32.19 SV31.19 SV29.19 | SV29.19 65.62,55.38 65.75,55.25 65.7,55.25 SV29.19
  Bottom 0.2: v70.5,52 67.12,55.38 SV29.19
N$175
  Top 0.5: IC21.1 68.43,56.82 67.33,57.92 SV29.20 SV31.20 SV32.20
N$176
  Top 0.5: SV30.1 78.49,14.96 IC22.11
  Bottom 0.5: SV30.1 SV33.1 SV34.1 | SV34.1 86.02,9.66 | 86.02,9.66 86.16,9.66 86.25,9.75 | SV34.1 86.02,9.86 86.02,9.66
N$177
  Top 0.5: IC22.12 79.61,16.64 81,15.25 81,13.8 82.6,12.2 SV33.2
  Bottom 0.5: SV34.2 SV33.2 SV30.2
N$178
  Top 0.5: IC22.13 80.17,17.91 SV33.3
  Bottom 0.5: SV30.3 SV33.3 SV34.3 | SV34.3 86.02,14.74 | 86.02,14.74 86.24,14.74 86.25,14.75 | SV34.3 86.02,14.76 86.02,14.74
N$179
  Top 0.5: IC22.14 75.44,19.18 73.53,17.28 SV30.4
  Bottom 0.5: SV30.4 SV33.4 SV34.4
N$180
  Top 0.5: SV30.5 74.42,19.82 75.09,20.5 75.14,20.45 IC22.15
  Bottom 0.5: SV34.5 SV33.5 SV30.5
N$181
  Top 0.5: IC22.16 73.83,21.73 SV30.6
  Bottom 0.5: SV34.6 SV33.6 SV30.6
N$182
  Top 0.5: IC22.17 75.5,23 73.6,24.9 SV30.7
  Bottom 0.5: SV30.7 SV33.7 SV34.7
N$183
  Top 0.5: IC22.18 80.02,24.27 83.19,27.44 SV33.8
  Bottom 0.5: SV34.8 83.41,27.44 | 83.41,27.44 SV33.8 | SV33.8 83.06,27.44 83,27.5 73.25,27.5 SV30.8 | SV33.8 83.41,27.48 83.41,27.44
N$184
  Top 0.5: IC22.19 79.53,25.54 80.75,26.75 80.75,28.25 82.5,30 83.08,30 | 83.08,30 83.5,30 | 83.08,30 83.08,30.09 SV33.9
  Bottom 0.5: SV30.9 SV33.9 SV34.9
N$185
  Top 0.5: IC22.20 78.49,27.22 SV30.10
  Bottom 0.5: SV30.10 SV33.10 SV34.10
N$186
  Top 0.5: IC21.11 78.49,40.36 SV30.11
  Bottom 0.5: SV30.11 SV33.11 SV34.11
N$187
  Top 0.5: IC21.12 79.7,42.05 81,40.75 81,38.75 82.15,37.6 SV33.12
  Bottom 0.5: SV34.12 SV33.12 SV30.12
N$188
  Top 0.5: IC21.13 79.94,43.31 83.11,40.14 SV33.13
  Bottom 0.5: SV30.13 SV33.13 SV34.13 86,40.25
N$189
  Top 0.5: IC21.14 80.42,44.59 82.32,42.68 SV33.14
  Bottom 0.5: SV30.14 SV33.14 SV34.14
N$190
  Top 0.5: IC21.15 80.64,45.85 81.28,45.22 SV33.15
  Bottom 0.5: SV30.15 SV33.15 SV34.15 | SV34.15 86.02,45.22 | 86.02,45.22 86.22,45.22 86.25,45.25 | SV34.15 86.02,45.42 86.02,45.22
N$191
  Top 0.5: IC21.16 80.62,47.12 81.26,47.76 SV33.16
  Bottom 0.5: SV30.16 SV33.16 SV34.16
N$192
  Top 0.5: IC21.17 80.39,48.4 82.3,50.3 SV33.17
  Bottom 0.5: SV30.17 SV33.17 SV34.17
N$193
  Top 0.5: IC21.18 79.67,49.66 82.84,52.84 SV33.18
  Bottom 0.5: SV30.18 SV33.18 SV34.18 | SV34.18 85.91,52.84 | 85.91,52.84 86,52.75 | SV34.18 86.02,52.92 85.91,52.84
N$194
  Top 0.5: IC21.19 78.55,51 79.75,51 80.5,51.75 80.5,53.75 82.13,55.38 SV33.19
  Bottom 0.5: SV34.19 SV33.19 SV30.19
N$195
  Top 0.5: IC22.10 68.88,15.38 69,15.25 69,12 66.66,9.66 SV29.1 SV31.1 SV32.1
N$196  (via drill 0.35)
  Top 0.5: IC22.8 69.33,18 v69.45,17.9
  Bottom 0.5: v69.45,17.9 66.24,14.74 SV29.3 SV31.3 SV32.3
N$197
  Top 0.5: IC22.4 67.47,23 SV29.7 SV31.7 SV32.7
N$198  (via drill 0.35)
  Top 0.254: IC21.8 v69.5,43.31
  Top 0.5: SV32.13 SV31.13 SV29.13
  Bottom 0.5: SV29.13 68.75,43.31 v69.5,43.31
N$199
  Top 0.5: IC21.4 67.47,48.4 SV29.17 SV31.17 SV32.17
N$200
  Top 0.5: IC21.20 78.49,54.26 74.83,57.92 SV30.20
  Bottom 0.5: SV30.20 SV33.20 SV34.20
N$201
  Top 0.5: SV54.8 134.07,74.35 134.07,76.96 SV49.8 134.07,77.29 134.07,79.9 U$3.23
N$202
  Top 0.5: U$1.TX0 116.13,47.6 116.13,45.32 SV53.1 116.13,44.99 116.13,42.38 SV52.1
N$203
  Top 0.5: U$1.RX1 118.74,47.6 118.74,45.32 SV53.2 118.74,44.99 118.74,42.38 SV52.2
N$204
  Top 0.5: U$1.RST1 121.35,47.6 121.35,45.32 SV53.3 121.35,44.99 121.35,42.38 SV52.3
N$206
  Top 0.5: U$1.D2 126.57,47.6 126.57,45.32 SV53.5 126.24,44.99 126.24,42.38 SV52.5
N$207
  Top 0.5: U$1.D3 128.85,47.6 128.85,45.32 SV53.6 128.85,44.99 128.85,42.38 SV52.6
N$208
  Top 0.5: U$1.D4 131.46,47.6 131.46,45.32 SV53.7 131.46,44.99 131.46,42.38 SV52.7
N$209
  Top 0.5: U$1.D5 134.07,47.6 134.07,45.32 SV53.8 134.07,44.99 134.07,42.38 SV52.8
N$210
  Top 0.5: U$3.15 116.13,105.02 116.13,107.3 SV48.1 116.13,107.62 116.13,110.23 SV50.1
N$211
  Top 0.5: U$3.14 118.74,105.02 118.74,107.3 SV48.2 118.74,107.62 118.74,110.23 SV50.2
N$212
  Top 0.5: U$3.13 121.35,105.02 121.35,107.3 SV48.3 121.35,107.62 121.35,110.23 SV50.3
N$213
  Top 0.5: U$3.12 123.63,105.02 123.63,107.3 SV48.4 123.63,107.62 123.63,110.23 SV50.4
N$214
  Top 0.5: U$3.11 126.24,105.02 126.24,107.3 SV48.5 126.24,107.62 126.24,110.23 SV50.5
N$215
  Top 0.5: U$3.10 128.85,105.02 128.85,107.3 SV48.6 128.85,107.62 128.85,110.23 SV50.6
N$216
  Top 0.5: U$3.9 131.46,105.02 131.46,107.3 SV48.7 131.46,107.62 131.46,110.23 SV50.7
N$217
  Top 0.5: U$3.8 134.07,105.02 134.07,107.3 SV48.8 134.07,107.62 134.07,110.23 SV50.8
N$239  (via drill 0.35)
  Top 0.5: SV2.2 SV1.2 SV58.2 | v32,14.25 32,16 31.11,16.89 IC11.9
  Bottom 0.5: SV58.2 30.2,12.45 v32,14.25
N$241
  Top 0.5: IC11.7 28.98,19.43 SV58.4 SV1.4 SV2.4
N$242
  Top 0.5: IC11.6 27.7,20.7 SV58.5 SV1.5 SV2.5 | SV2.5 21.93,20.07 21.75,20.25 21.81,20.25 SV2.5
N$243
  Top 0.5: IC11.5 27.7,21.98 SV58.6 SV1.6 SV2.6
N$245  (via drill 0.35)
  Top 0.2: IC11.3 30.98,24.52 v31,24.5
  Bottom 0.2: v31,24.5 30.26,24.5 SV58.8
  Bottom 0.5: SV58.8 SV1.8 22.08,27.69 | 22.08,27.69 SV2.8 | SV2.8 21.81,27.69 21.75,27.75 | SV2.8 22.08,27.8 22.08,27.69
N$246  (via drill 0.35)
  Top 0.2: IC11.2 30.79,25.79 v32,27
  Bottom 0.2: v32,27 28.77,30.23 SV58.9
  Bottom 0.5: SV58.9 SV1.9 22.08,30.23 | 22.08,30.23 SV2.9 | SV2.9 21.77,30.23 21.75,30.25 | SV2.9 22.08,30.41 22.08,30.23
N$247
  Top 0.5: IC11.1 29.93,32.07 29.23,32.77 SV58.10 SV1.10 24.36,32.7 24.36,32.77 | SV2.10 24.36,32.77 | 24.36,32.77 24.48,32.77
N$248
  Top 0.5: SV2.11 SV1.11 SV58.11 28.56,35.31 30,36.75 30,40.96 IC4.10
N$249  (via drill 0.35)
  Top 0.5: SV2.12 SV1.12 | SV1.12 24.6,37.85 | 24.6,37.85 24.75,38 | SV58.12 24.6,37.85 | IC4.9 30.95,42.3 v32,41.25 | SV1.12 24.69,37.91 24.6,37.85
  Bottom 0.5: v32,41.25 28.6,37.85 SV58.12
N$251
  Top 0.5: IC4.7 28.98,44.84 SV58.14 SV1.14 SV2.14 | SV2.14 21.93,42.93 21.75,42.75 21.81,42.75 SV2.14
N$252
  Top 0.5: IC4.6 27.7,46.1 SV58.15 SV1.15 SV2.15
N$253
  Top 0.5: IC4.5 27.7,47.38 SV58.16 SV1.16 SV2.16
N$255  (via drill 0.35)
  Top 0.2: IC4.3 30.91,49.91 v31,49.95
  Top 0.5: SV2.18 SV1.18 SV58.18
  Bottom 0.2: v31,49.95 29.73,51.23 27.91,53.09 SV58.18
N$256  (via drill 0.35)
  Top 0.2: IC4.2 30.93,51.19 v32,52.25
  Top 0.5: SV2.19 SV1.19 SV58.19 | SV58.19 27.12,55.63 27.25,55.5 27.2,55.5 SV58.19
  Bottom 0.2: v32,52.25 28.62,55.63 SV58.19
N$257
  Top 0.5: IC4.1 29.93,57.07 28.83,58.17 SV58.20 SV1.20 SV2.20
N$258
  Top 0.5: SV59.1 39.99,15.21 IC11.11
  Bottom 0.5: SV59.1 SV3.1 SV4.1 | SV4.1 47.52,9.91 | 47.52,9.91 47.66,9.91 47.75,10 | SV4.1 47.52,9.86 47.52,9.91
N$259
  Top 0.5: IC11.12 41.1,16.89 42.5,15.5 42.5,14.05 44.1,12.45 SV3.2
  Bottom 0.5: SV4.2 SV3.2 SV59.2
N$260
  Top 0.5: IC11.13 41.67,18.16 SV3.3
  Bottom 0.5: SV59.3 SV3.3 SV4.3 | SV4.3 47.52,14.99 | 47.52,14.99 47.74,14.99 47.75,15 | SV4.3 47.52,15.08 47.52,14.99
N$261
  Top 0.5: IC11.14 36.94,19.43 35.03,17.53 SV59.4
  Bottom 0.5: SV59.4 SV3.4 SV4.4
N$262
  Top 0.5: SV59.5 35.91,20.07 36.59,20.75 36.64,20.7 IC11.15
  Bottom 0.5: SV4.5 SV3.5 SV59.5
N$263
  Top 0.5: IC11.16 35.33,21.98 SV59.6
  Bottom 0.5: SV4.6 SV3.6 SV59.6
N$264
  Top 0.5: IC11.17 37.01,23.25 35.1,25.15 SV59.7
  Bottom 0.5: SV59.7 SV3.7 SV4.7
N$265
  Top 0.5: IC11.18 41.52,24.52 44.69,27.69 SV3.8
  Bottom 0.5: SV4.8 44.91,27.69 | 44.91,27.69 SV3.8 | SV3.8 44.56,27.69 44.5,27.75 34.75,27.75 SV59.8 | SV3.8 44.91,27.8 44.91,27.69
N$266
  Top 0.5: IC11.19 41.03,25.79 42.25,27 42.25,28.5 44,30.25 44.59,30.25 | 44.59,30.25 45,30.25 | 44.59,30.25 44.59,30.41 SV3.9
  Bottom 0.5: SV59.9 SV3.9 SV4.9
N$267
  Top 0.5: IC11.20 39.99,27.47 SV59.10
  Bottom 0.5: SV59.10 SV3.10 SV4.10
N$268
  Top 0.5: IC4.11 39.99,40.61 SV59.11
  Bottom 0.5: SV59.11 SV3.11 SV4.11
N$269
  Top 0.5: IC4.12 41.2,42.3 42.5,41 42.5,39 43.65,37.85 SV3.12
  Bottom 0.5: SV4.12 SV3.12 SV59.12
N$270
  Top 0.5: IC4.13 41.44,43.56 44.61,40.39 SV3.13
  Bottom 0.5: SV59.13 SV3.13 SV4.13 47.5,40.5
N$271
  Top 0.5: IC4.14 41.91,44.84 43.82,42.93 SV3.14
  Bottom 0.5: SV59.14 SV3.14 SV4.14
N$272
  Top 0.5: IC4.15 42.15,46.1 42.78,45.47 SV3.15
  Bottom 0.5: SV59.15 SV3.15 SV4.15 | SV4.15 47.52,45.47 | 47.52,45.47 47.72,45.47 47.75,45.5 | SV4.15 47.52,45.42 47.52,45.47
N$273
  Top 0.5: IC4.16 42.12,47.38 42.76,48.01 SV3.16
  Bottom 0.5: SV59.16 SV3.16 SV4.16
N$274
  Top 0.5: IC4.17 41.9,48.65 43.8,50.55 SV3.17
  Bottom 0.5: SV59.17 SV3.17 SV4.17
N$275
  Top 0.5: IC4.18 41.16,49.91 44.34,53.09 SV3.18
  Bottom 0.5: SV59.18 SV3.18 SV4.18 | SV4.18 47.41,53.09 | 47.41,53.09 47.5,53 | SV4.18 47.52,53.25 47.41,53.09
N$276
  Top 0.5: IC4.19 40.05,51.25 41.25,51.25 42,52 42,54 43.63,55.63 SV3.19
  Bottom 0.5: SV4.19 SV3.19 SV59.19
N$278
  Top 0.5: IC11.10 30.38,15.62 30.5,15.5 30.5,12.25 28.16,9.91 SV58.1 SV1.1 SV2.1
N$279  (via drill 0.35)
  Top 0.5: IC11.8 30.84,18.25 v30.95,18.15
  Bottom 0.5: v30.95,18.15 27.74,14.99 SV58.3 SV1.3 SV2.3
N$281
  Top 0.5: IC11.4 28.98,23.25 SV58.7 SV1.7 SV2.7
N$284  (via drill 0.35)
  Top 0.254: IC4.8 v31,43.56
  Top 0.5: SV2.13 SV1.13 SV58.13
  Bottom 0.5: SV58.13 30.25,43.56 v31,43.56
N$286
  Top 0.5: IC4.4 28.98,48.65 SV58.17 SV1.17 SV2.17
N$319
  Top 0.5: IC4.20 39.99,54.51 36.33,58.17 SV59.20
  Bottom 0.5: SV59.20 SV3.20 SV4.20
VCC
  pour Top (no thermals): -3.25,120 -3.25,-6 157.75,-6 157.75,120
VS
  Top 0.5: U$2.P$18 108.62,31.97 108.62,35.23 SV36.3 108.62,35.56 108.62,38.49 SV37.3 108.62,38.82 108.62,55.21 113.57,60.16 122.23,60.16 123.73,61.66 U$1.5V 123.96,63.26 123.96,65.87 SV47.4 123.63,66.2 123.63,68.81 SV51.4 123.73,70.41 124.89,71.57 150.65,71.57 151.62,72.54 SV42.7 151.68,74.35 151.68,76.96 SV43.7 151.68,77.29 151.68,79.9 U$3.30

## Text on the board
tNames: Arduino Nano | Breakout board by Peter Dunne / Copyright ©2021, Released under the Creative Commons License